# Altium schematic sheet Sheet1.SchDoc
size A4; Organization: HTBLVA Anichstraße; Address1: WPF Embedded Systems; Address2: Anichstraße 26-28; Address3: A-6020 Innsbruck; Address4: Austria; DocumentNumber: 1; SheetNumber: 1; SheetTotal: 1; PageSetup: Record=PageOptions|CenterHorizontal=True|CenterVertical=True|PrintScale=1.00|XCorrection=1.00|YCorrection=1.00|PrintKind=0|BorderSize=5000000|LeftOffset=0|BottomOffset=0|Orientation=2|PaperLength=1000|PaperWidth=1000|Scale=100|PaperSource=7|PrintQuality=-4|MediaType=1|DitherType=10|PaperKind=A4|PrintScaleMode=1; SPICEModelCacheJUCKQXHS: <root> / <DocumentId>JUCKQXHS</DocumentId> / <CacheFrame Number="0"> / <Model Name="led_red" Kind="MDL"> / <Text>*Typ RED GaAs LED: Vf=1.7V Vr=4V If=40mA trr=3uS / *LED Pinout: 1=A, 2=K / .MODEL LED_RED D (IS=93.2P RS=42M N=3.73 BV=4 IBV=10U / + CJO=2.97P VJ=.75 M=.333 TT=4.32U)</Text> / </Model> / <Model Name="led_grn_yel" Kind="MDL"> / <Text>*Typ RED,GREEN,YELLOW,AMBER GaAs LED: Vf=2.1V Vr=4V If=40mA trr=3uS / *LED Pinout: 1=A, 2=K / .MODEL LED_GRN_YEL D (IS=93.1P RS=42M N=4.61 BV=4 IBV=10U / + CJO=2.97P VJ=.75 M=.333 TT=4.32U)</Text> / </Model> / </CacheFrame> / </root>
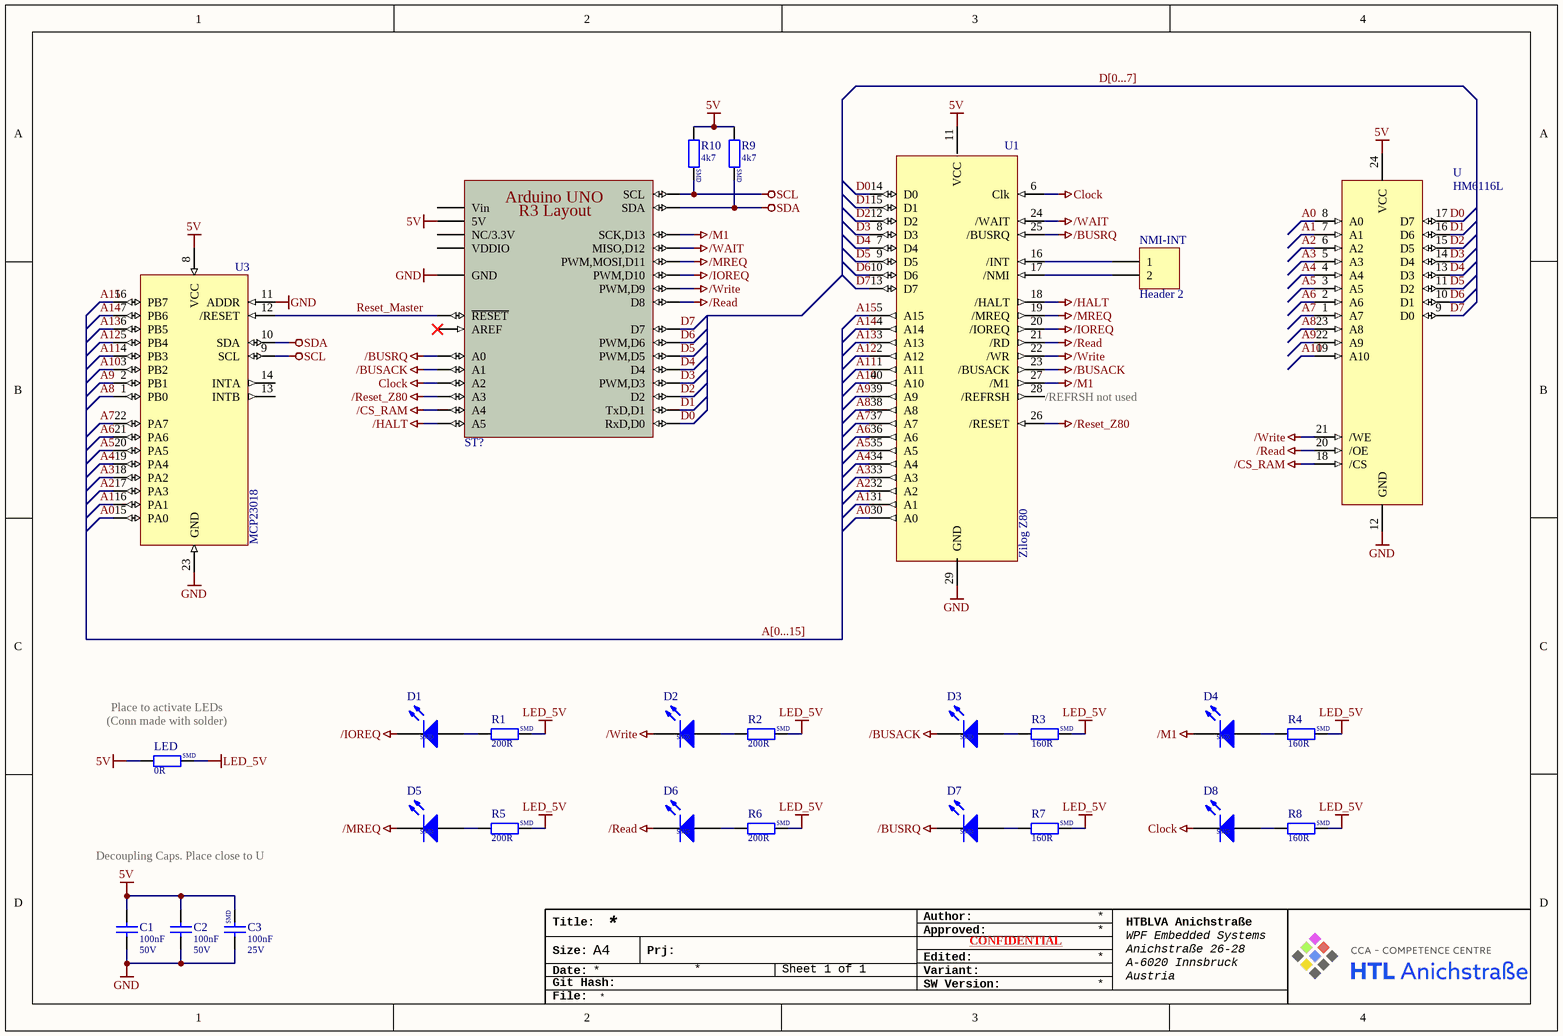
[diagram p0: Sheet1.SchDoc]

## Parts
C1  Rated Voltage: 50V  [C_RM2-025X075]  (hidden comment: 100nF)
C2  Rated Voltage: 50V  [C_RM2-025X075]  (hidden comment: 100nF)
C3  Rated Voltage: 25V  [C_SMD_C0805]  (hidden comment: 100nF)
D1  SMD LED RED  [SMD_0805_CHIP-LED - RED]  (value not drawn)
D2  SMD LED RED  [SMD_0805_CHIP-LED - RED]  (value not drawn)
D3  SMD LED GREEN  [SMD_0805_CHIP-LED - GREEN]  (value not drawn)
D4  SMD LED YELLOW  [SMD_0805_CHIP-LED - YELLOW]  (value not drawn)
D5  SMD LED RED  [SMD_0805_CHIP-LED - RED]  (value not drawn)
D6  SMD LED RED  [SMD_0805_CHIP-LED - RED]  (value not drawn)
D7  SMD LED GREEN  [SMD_0805_CHIP-LED - GREEN]  (value not drawn)
D8  SMD LED YELLOW  [SMD_0805_CHIP-LED - YELLOW]  (value not drawn)
LED  0R  [R_SMD_R1206]
NMI-INT  Header 2  [HDR1X2]
R1  200R  [R_SMD_R0805]
R2  200R  [R_SMD_R0805]
R3  160R  [R_SMD_R0805]
R4  160R  [R_SMD_R0805]
R5  200R  [R_SMD_R0805]
R6  200R  [R_SMD_R0805]
R7  160R  [R_SMD_R0805]
R8  160R  [R_SMD_R0805]
R9  4k7  [R_SMD_R0805]
R10  4k7  [R_SMD_R0805]
ST?  Arduino_UNO_R3_Layout  [Arduino UNO Rev3 Layout]  (value not drawn)
U  HM6116L  [HM6116L]
U1  Zilog Z80  [Z80]
U3  MCP23018  [MCP23018]

## Nets
5V: C1.2 C2.2 C3.2 LED.1 R9.1 R10.1 ST?.5V U.24(VCC) U1.11(VCC) U3.8(VCC)
/BUSACK: D3.K ST?.A1 U1.23(/BUSACK)
/BUSRQ: D7.K ST?.A0 U1.25(/BUSRQ)
/CS_RAM: ST?.A4 U.18(/CS)
/HALT: ST?.A5 U1.18(/HALT)
/IOREQ: D1.K ST?.D10(PWM,D10) U1.20(/IOREQ)
/M1: D4.K ST?.D13_SCK(SCK,D13) U1.27(/M1)
/MREQ: D5.K ST?.D11_MOSI(PWM,MOSI,D11) U1.19(/MREQ)
/Read: D6.K ST?.D8 U.20(/OE) U1.21(/RD)
/Reset_Z80: ST?.A3 U1.26(/RESET)
/WAIT: ST?.D12_MISO(MISO,D12) U1.24(/WAIT)
/Write: D2.K ST?.D9(PWM,D9) U.21(/WE) U1.22(/WR)
Clock: D8.K ST?.A2 U1.6(Clk)
GND: C1.1 C2.1 C3.1 ST?.GND U.12(GND) U1.29(GND) U3.11(ADDR) U3.23(GND)
LED_5V: LED.2 R1.2 R2.2 R3.2 R4.2 R5.2 R6.2 R7.2 R8.2
SCL: R10.2 ST?.SCL U3.9(SCL)
SDA: R9.2 ST?.SDA U3.10(SDA)
A0: U.8(A0) U1.30(A0) U3.15(PA0)
A1: U.7(A1) U1.31(A1) U3.16(PA1)
A2: U.6(A2) U1.32(A2) U3.17(PA3)
A3: U.5(A3) U1.33(A3) U3.18(PA2)
A4: U.4(A4) U1.34(A4) U3.19(PA4)
A5: U.3(A5) U1.35(A5) U3.20(PA5)
A6: U.2(A6) U1.36(A6) U3.21(PA6)
A7: U.1(A7) U1.37(A7) U3.22(PA7)
A8: U.23(A8) U1.38(A8) U3.1(PB0)
A9: U.22(A9) U1.39(A9) U3.2(PB1)
A10: U.19(A10) U1.40(A10) U3.3(PB2)
A11: U1.1(A11) U3.4(PB3)
A12: U1.2(A12) U3.5(PB4)
A13: U1.3(A13) U3.6(PB5)
A14: U1.4(A14) U3.7(PB6)
A15: U1.5(A15) U3.16(PB7)
D0: ST?.D0_RX(RxD,D0) U.17(D7) U1.14(D0)
D1: ST?.D1_TX(TxD,D1) U.16(D6) U1.15(D1)
D2: ST?.D2 U.15(D5) U1.12(D2)
D3: ST?.D3(PWM,D3) U.14(D4) U1.8(D3)
D4: ST?.D4 U.13(D3) U1.7(D4)
D5: ST?.D5(PWM,D5) U.11(D2) U1.9(D5)
D6: ST?.D6(PWM,D6) U.10(D1) U1.10(D6)
D7: ST?.D7 U.9(D0) U1.13(D7)
Reset_Master: ST?.RESET(~{RESET}) U3.12(/RESET)
NetD1_A: D1.A R1.1
NetD2_A: D2.A R2.1
NetD3_A: D3.A R3.1
NetD4_A: D4.A R4.1
NetD5_A: D5.A R5.1
NetD6_A: D6.A R6.1
NetD7_A: D7.A R7.1
NetD8_A: D8.A R8.1
NetNMI-INT_1: NMI-INT.1 U1.16(/INT)
NetNMI-INT_2: NMI-INT.2 U1.17(/NMI)

Not connected (* = marked no-connect by the designer): ST? 33V(NC/3.3V) AREF* VDDIO VIN(Vin); U1 28(/REFRSH); U3 13(INTB) 14(INTA)

## Buses and harness runs
bus A[0...15]
bus D[0...7]

## Notes on the sheet
- (near U1) /REFRSH not used
- (near LED) Place to activate LEDs
- (near LED) (Conn made with solder)
- Decoupling Caps. Place close to U
- Title:
- Author:
- Approved:
- Size:
- Date:
- Git Hash:
- A4
- Prj:
- SW Version:
- Variant:
- Edited:
- CONFIDENTIAL
- File:
- (in symbol Arduino_UNO_R3_Layout) Arduino UNO; R3 Layout
- (in symbol C_SMD) SMD
- (in symbol R_SMD) SMD
- (in symbol SMD_LED_GREEN) SMD
- (in symbol SMD_LED_RED) SMD
- (in symbol SMD_LED_YELLOW) SMD

## Library data of the parts
C1 C2 = C: Capacitor; Usage: only permitted for non-commercial purposes at HTL I Innsbruck; Published: 21-Feb-2011; LatestRevisionDate: 07-Sep-2019; Value: 100nF
C3 = C_SMD: SMD Capacitor; Usage: only permitted for non-commercial purposes at HTL I Innsbruck; Published: 21-Feb-2011; LatestRevisionDate: 07-Sep-2019; Value: 100nF
D1 D2 D5 D6 = SMD_LED_RED: Red GaAs LED (Vf=1.7V, If=40mA); Usage: only permitted for non-commercial purposes at HTL I Innsbruck; SimulationModellSource: Miscellaneous Devices; Published: 29-Mar-2017; LatestRevisionDate: 21-Jun-2015
D3 D7 = SMD_LED_GREEN: Green GaAs LED (Vf=2.1V, If=40mA); Usage: only permitted for non-commercial purposes at HTL I Innsbruck; SimulationModellSource: Miscellaneous Devices; Published: 29-Mar-2017; LatestRevisionDate: 21-Jun-2015
D4 D8 = SMD_LED_YELLOW: Yellow GaAs LED (Vf=2.1V, If=40mA); Usage: only permitted for non-commercial purposes at HTL I Innsbruck; SimulationModellSource: Miscellaneous Devices; Published: 29-Mar-2017; LatestRevisionDate: 21-Jun-2015
LED R1-R10 = R_SMD: SMD Resistor; Usage: only permitted for non-commercial purposes at HTL I Innsbruck; Published: 21-Feb-2011; LatestRevisionDate: 07-Sep-2019
  LED: Value: 0R
  R1 R2 R5 R6: Value: 200R
  R3 R4 R7 R8: Value: 160R
  R9 R10: Value: 4k7
NMI-INT = Header 2: Header, 2-Pin; LatestRevisionDate: 17-Jul-2002; LatestRevisionNote: Re-released for DXP Platform.; Publisher: Altium Limited
ST? = Arduino_UNO_R3_Layout: Arduino UNO r3 Layout; Usage: only permitted for non-commercial purposes at HTL I Innsbruck; Publisher: Michael Kupfner; Published: 10-Mar-2015; LatestRevisionDate: 10-Mar-2015
U = HM6116L: 2kbyte SRAM
U1 = Zilog Z80: https://www.zilog.com/docs/z80/um0080.pdf